# EAGLE schematic data_comm_schematic (EAGLE 8.6.0)
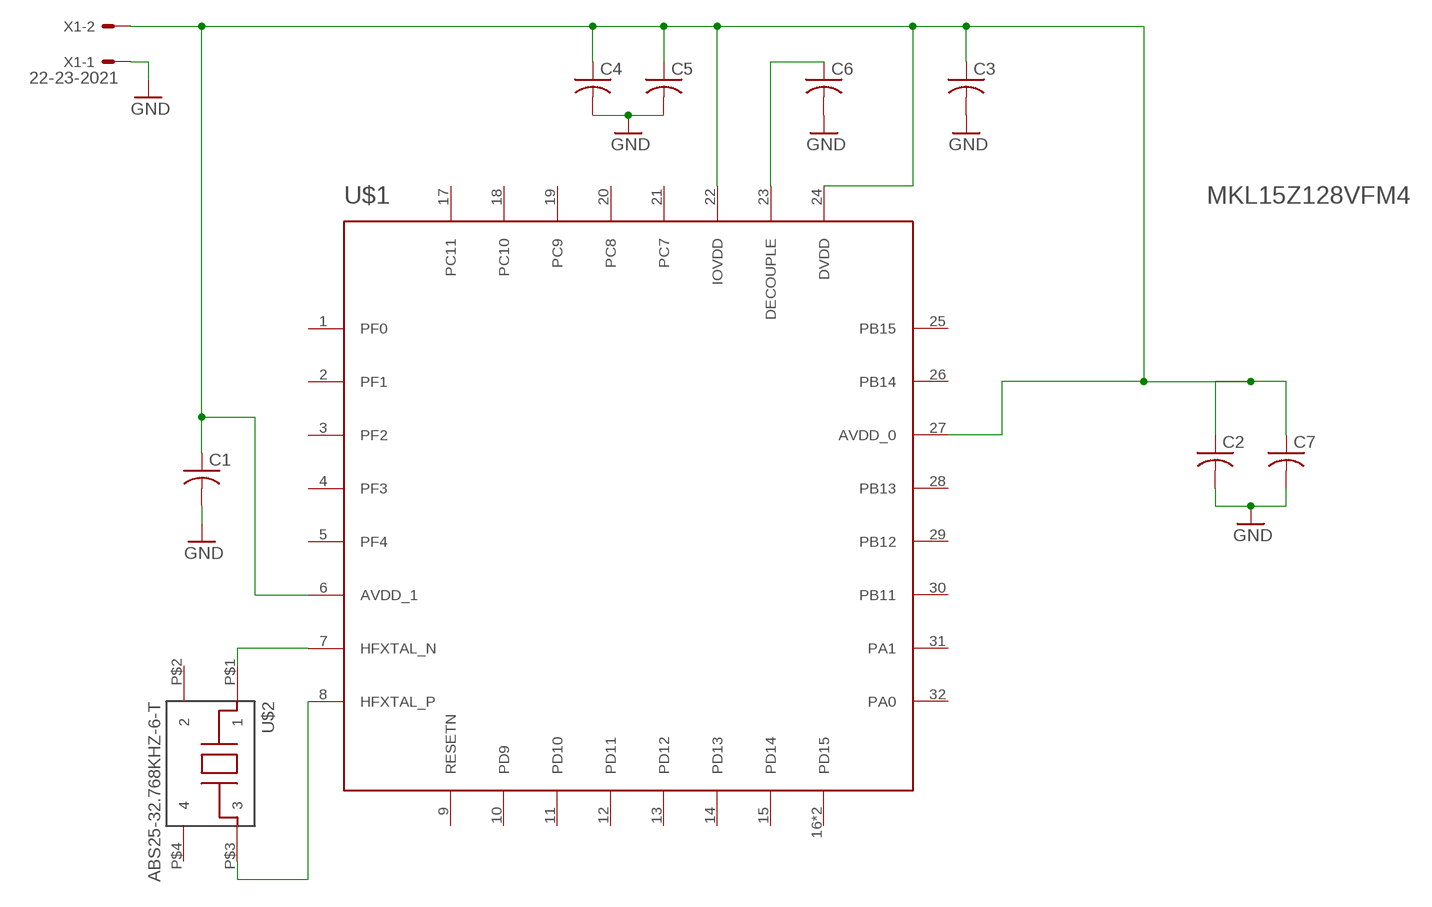
[diagram p0: schematic, sheet 1]

## Parts
C1  C-US025-024X044  [C025-024X044]
C2  C-US025-024X044  [C025-024X044]
C3  C-US025-024X044  [C025-024X044]
C4  C-US025-024X044  [C025-024X044]
C5  C-US025-024X044  [C025-024X044]
C6  C-US025-024X044  [C025-024X044]
C7  C-US025-024X044  [C025-024X044]
U$1  MKL15Z128VFM4  [QFN32]
U$2  ABS25-32.768KHZ-6-T  [OSC]
X1  22-23-2021  [22-23-2021]

## Nets
GND: C1.2 C3.2 C4.2 C5.2 C6.2 X1.1
N$1: C1.1 C2.1 C3.1 C4.1 C5.1 C7.1 U$1.6(AVDD_1) U$1.22(IOVDD) U$1.24(DVDD) U$1.27(AVDD_0) X1.2
N$2: C2.2 C7.2 ; supply symbol labelled GND
N$3: C6.1 U$1.23(DECOUPLE)
N$4: U$1.7(HFXTAL_N) U$2.P$1
N$5: U$1.8(HFXTAL_P) U$2.P$3
Unconnected: U$1.1(PF0) U$1.2(PF1) U$1.3(PF2) U$1.4(PF3) U$1.5(PF4) U$1.9(RESETN) U$1.10(PD9) U$1.11(PD10) U$1.12(PD11) U$1.13(PD12) U$1.14(PD13) U$1.15(PD14) U$1.16(PD15) U$1.17(PC11) U$1.18(PC10) U$1.19(PC9) U$1.20(PC8) U$1.21(PC7) U$1.25(PB15) U$1.26(PB14) U$1.28(PB13) U$1.29(PB12) U$1.30(PB11) U$1.31(PA1) U$1.32(PA0) U$1.HEATSINK(PD15) U$2.P$2 U$2.P$4

## Library data of the parts
C1-C7 = rcl:C-US: CAPACITOR, American symbol; SPICEPREFIX: C
U$1 = QFN32:MKL15Z128VFM4
U$2 = QFN32:ABS25-32.768KHZ-6-T
X1 = con-molex:22-23-2021: .100" (2.54mm) Center Header - 2 Pin; MF: MOLEX; MPN: 22-23-2021; OC_FARNELL: 1462926; OC_NEWARK: 25C3832